# EAGLE design AutomaTiles_LiPo_Charger (EAGLE 7.1.0)
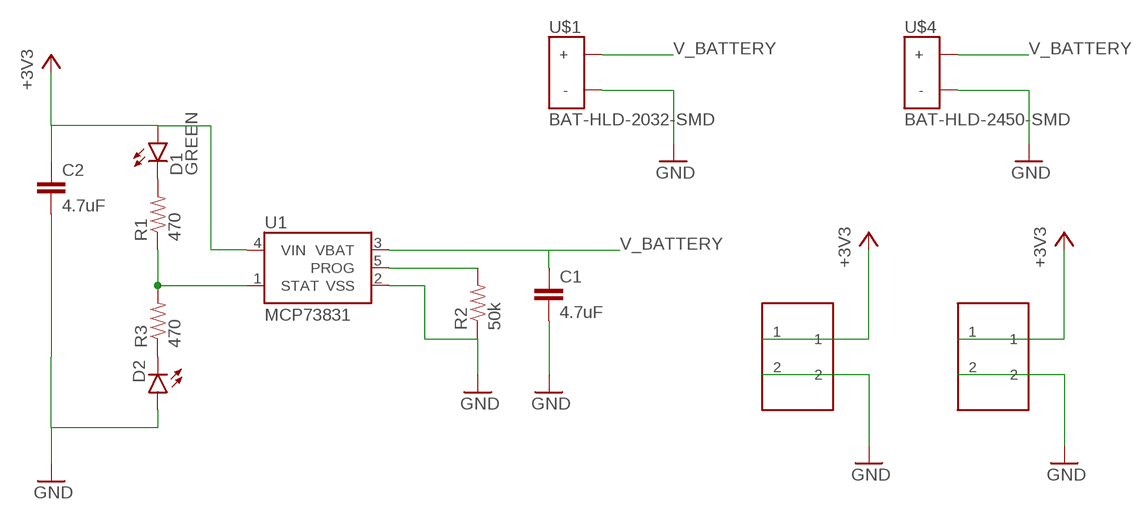
[diagram p0: schematic, sheet 1]

## Parts
C1  4.7uF  4.7UF-6.3V-10%(0603)0603  [0603-CAP]
C2  4.7uF  4.7UF-6.3V-10%(0603)0603  [0603-CAP]
D1  GREEN  LED-GREEN0603  [LED-0603]
D2  LED-YELLOW0603  [LED-0603]
R1  470  470OHM1/10W1%(0603)  [0603-RES]
R2  50k  2.0KOHM1/10W5%(0603)  [0603-RES]
R3  470  470OHM1/10W1%(0603)  [0603-RES]
U1  MCP73831  [SOT23-5]
U$1  BAT-HLD-2032-SMD  [BAT-HLD-2032-SMD]
U$2  1X2_FEMALE_HEADER  [1X2_FEMALE_HEADER]
U$3  1X2_FEMALE_HEADER  [1X2_FEMALE_HEADER]
U$4  BAT-HLD-2450-SMD  [BAT-HLD-2450-SMD]

## Nets
+3V3: C2.1 D1.A U1.4(VIN) U$2.1 U$3.1
GND: C1.2 C2.2 D2.A R2.1 U1.2(VSS) U$1.GND(-) U$2.2 U$3.2 U$4.GND(-)
N$1: R1.1 R3.2 U1.1(STAT)
N$2: R2.2 U1.5(PROG)
N$3: D1.C R1.2
N$4: D2.C R3.1
V_BATTERY: C1.1 U1.3(VBAT) U$1.POS1(+) U$1.POS2(+) U$4.POS1(+) U$4.POS2(+)

## Library data of the parts
C1 C2 = SparkFun-Capacitors:4.7UF-6.3V-10%(0603): CAP-08280; PROD_ID: CAP-08280
D1 = SparkFun-LED:LED-GREEN: Various green LEDs Green LEDs used in SFE Production 0603- DIO-00821 LARGE- DIO-00862 LILYPAD- DIO-09910; PROD_ID: DIO-00821
D2 = SparkFun-LED:LED-YELLOW: Yellow SMD LEDs LilyPad 1206- DIO-09909 0603- DIO-09003; PROD_ID: DIO-09003
R1 R3 = SparkFun-Resistors:470OHM1/10W1%(0603): RES-07869; PROD_ID: RES-07869
R2 = SparkFun-Resistors:2.0KOHM1/10W5%(0603): RES-08296; PROD_ID: RES-08296; VALUE: 2.0k
U1 = SparkFun-PowerIC:MCP73831: Miniature single cell, fully integrated Li-Ion, Li-polymer charge management controller http://ww1.microchip.com/downloads/en/DeviceDoc/21984a.pdf IC-09995; PROD_ID: IC-09995
U$1 = batteries:BAT-HLD-2032-SMD: SMD battery holder for 2032 coincell; DIGIKEY: BK-912-ND
U$2 U$3 = headers:1X2_FEMALE_HEADER
U$4 = batteries:BAT-HLD-2450-SMD

## Board
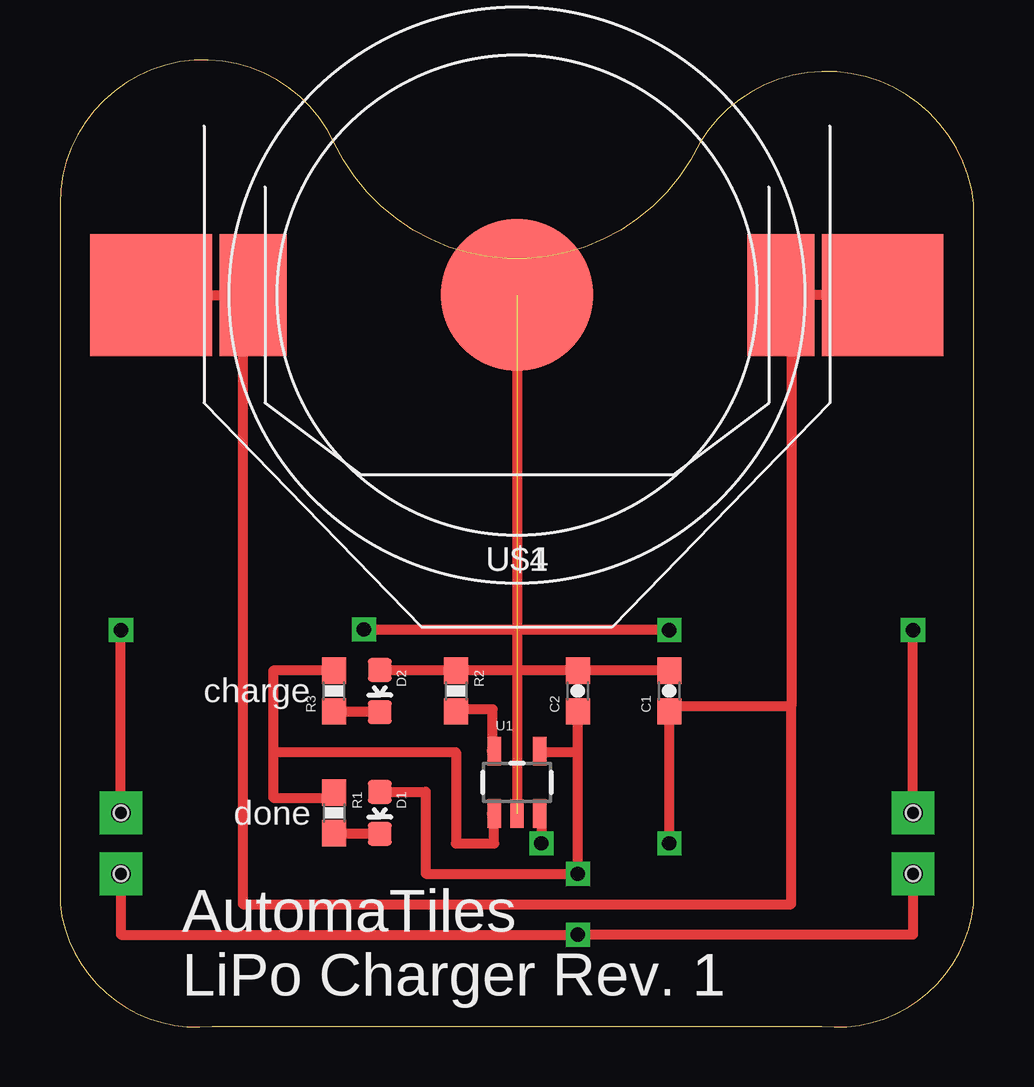
[diagram p1: board, top side]
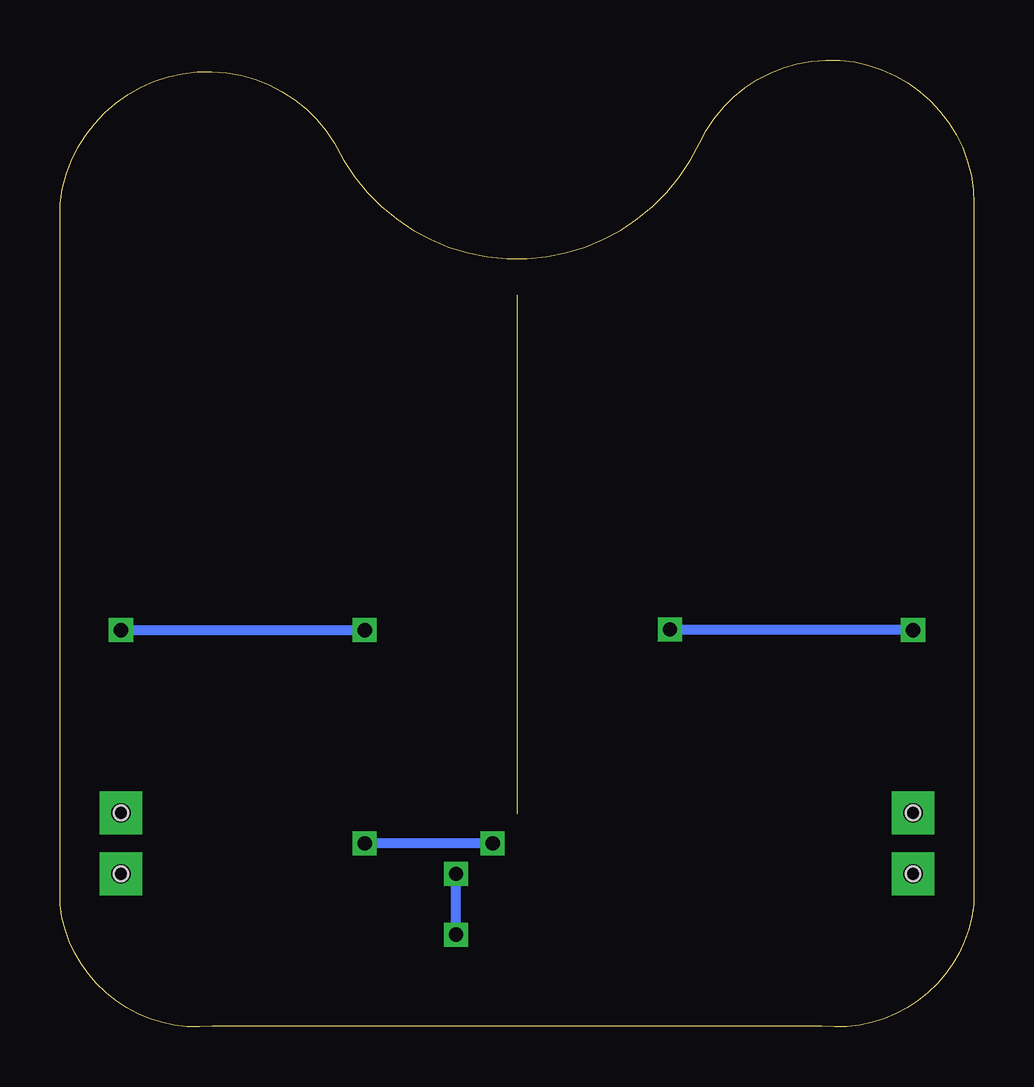
[diagram p2: board, bottom side, seen from below]

Size 38.1 x 40.31 mm. Coordinates in mm from the lower left corner, seen from the top.
Outline: 0,5.11 arc90 6.35,0.03 31.75,0.03 arc90 38.1,5.11 38.1,33.53 38.1,34.32 arc142 26.67,36.86 arc-130 11.43,36.86 arc155 0,34.31 0,5.11
Copper layers (1*16): Top 0.035mm / dielectric 1.5mm / Bottom 0.035mm
Design rules "default": minimum track width 10mil, minimum drill 24mil, track to track 8mil, track to pad 8mil, pad to pad 8mil, via to via 8mil, smd to smd 8mil, copper to edge 40mil, drill to drill 8mil, minimum pad ring 10mil, minimum via ring 8mil, stop-mask expansion 4mil, vias tented up to drill 0mil, thermal gap 10mil

### Footprints (pad centres in the part's own frame; a part is rotated, then mirrored left to right if it is on the bottom)
0603-CAP = smd 1.1 x 1: 1 -0.85,0; 2 0.85,0
LED-0603 = smd 1 x 1: A 0,-0.877; C 0,0.877
0603-RES = smd 1.1 x 1: 1 -0.85,0; 2 0.85,0
SOT23-5 = smd 0.55 x 1.2: 1 -0.95,-1.3; 2 0,-1.3; 3 0.95,-1.3; 4 0.95,1.3; 5 -0.95,1.3
BAT-HLD-2032-SMD = smd 6.35 x 6.35: GND 0,0 | smd 2.79 x 5.08: POS1 -11,0; POS2 11,0
1X2_FEMALE_HEADER = drill 0.8 pad 1.778 square: 1 0,1.27; 2 0,-1.27 | hole 0.6: 0,1.27; 0,-1.27
BAT-HLD-2450-SMD = smd 6.35 x 6.35: GND 0,0 | smd 5.08 x 5.08: POS1 -15.24,0; POS2 15.24,0

### Placement (x,y rotation side)
C1  25.4,14 90 top
C2  21.59,14 90 top
D1  13.34,8.92 180 top
D2  13.34,14 180 top
R1  11.43,8.92 270 top
R2  16.51,14 270 top
R3  11.43,14 90 top
U1  19.05,10.19 0 top
U$1  19.05,30.51 180 top
U$2  2.54,7.65 180 top
U$3  35.56,7.65 180 top
U$4  19.05,30.51 180 top

### Tracks (layer width: path | path; a pad name or v marks a point on that pad's centre or on a via)
+3V3  (via drill 0.6)
  Top 0.406: U$2.1 2.54,3.84 v21.59,3.84 35.56,3.84 U$3.1 | 21.59,11.46 v21.59,6.38 15.24,6.38 15.24,9.8 D1.A | 21.59,11.46 C2.1 | U1.4 20,11.46 21.59,11.46
  Bottom 0.406: v21.59,3.84 v21.59,6.38
GND  (via drill 0.6)  (2 unrouted)
  Top 0.406: U$4.GND 19.05,16.57 | 19.05,16.54 19.05,14.85 | C1.2 C2.2 19.05,14.85 | 19.05,14.85 R2.1 13.34,14.85 D2.A | 19.05,14.85 U1.2 | U$2.2 v2.54,16.54 | U$3.2 v35.56,16.54 | v25.4,16.54 19.05,16.54 | v12.68,16.57 19.05,16.57 | 19.05,16.57 19.05,16.54
  Bottom 0.406: v35.56,16.54 v25.4,16.54 | v2.54,16.54 12.68,16.54 v12.68,16.57
N$1
  Top 0.406: 18,8.89 U1.1 18.1,7.65 16.51,7.65 16.51,11.46 8.89,11.46 | R3.2 8.89,14.85 8.89,11.46 | 8.89,11.46 8.89,9.56 11.43,9.56 R1.1
N$2
  Top 0.406: U1.5 18.03,11.49 | 18,11.49 18.03,11.49 | 18.03,11.49 18.03,13.24 16.51,13.24 R2.2
N$3
  Top 0.406: D1.C 11.43,8.05 R1.2
N$4
  Top 0.406: D2.C 11.43,13.13 R3.1
V_BATTERY  (via drill 0.6)
  Top 0.406: 30.48,13.37 30.48,30.51 U$1.POS1 U$4.POS1 | 30.48,13.37 25.4,13.37 C1.1 v25.4,7.65 | 30.48,13.37 30.48,5.11 7.62,5.11 7.62,30.51 U$1.POS2 U$4.POS2 | U1.3 20.07,8.89 v20.07,7.65
  Bottom 0.406: v20.07,7.65 v25.4,7.65

### Text on the board
tNames: charge | done | AutomaTiles / LiPo Charger Rev. 1